# Altium schematic sheet InterfacesA_Xbee_Transceiver.SchDoc
size A
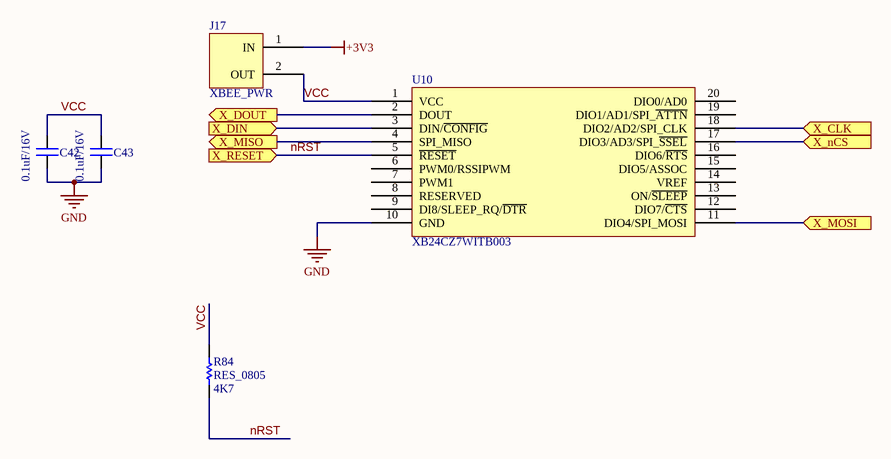
[diagram p0: InterfacesA_Xbee_Transceiver.SchDoc]

## Parts
C42  value 0.1uF/16V  [CAP_0805]  (hidden comment: CAP_0805)
C43  value 0.1uF/16V  [CAP_0805]  (hidden comment: CAP_0805)
J17  XBEE_PWR  [JUMPER 2 PIN]
R84  RES_0805  value 4K7  [RES_0805]
U10  XB24CZ7WITB003  [XB24CZ7WITB003]

## Ports
X_CLK (in), X_DIN (in), X_DOUT (out), X_MISO (out), X_MOSI (in), X_nCS (in), X_RESET (in)

## Nets
+3V3: J17.1(IN)
GND: C42.2 C43.2 U10.10(GND)
nRST: R84.1 U10.5(~{RESET}) ; port X_RESET
VCC: C42.1 C43.1 J17.2(OUT) R84.2 U10.1(VCC)
X_CLK: U10.18(DIO2/AD2/SPI_CLK) ; port X_CLK
X_DIN: U10.3(DIN/~{CONFIG}) ; port X_DIN
X_DOUT: U10.2(DOUT) ; port X_DOUT
X_MISO: U10.4(SPI_MISO) ; port X_MISO
X_MOSI: U10.11(DIO4/SPI_MOSI) ; port X_MOSI
X_nCS: U10.17(DIO3/AD3/SPI_~{SSEL}) ; port X_nCS

Not connected (* = marked no-connect by the designer): U10 6(PWM0/RSSIPWM) 7(PWM1) 8(RESERVED) 9(DI8/SLEEP_RQ/~{DTR}) 12(DIO7/~{CTS}) 13(ON/~{SLEEP}) 14(VREF) 15(DIO5/ASSOC) 16(DIO6/~{RTS}) 19(DIO1/AD1/SPI_~{ATTN}) 20(DIO0/AD0)

## Library data of the parts
C42 C43 = CAP_0603
J17 = JUMPER 2 PIN
U10 = XB24CZ7WITB003: XBEE MODULE